# Altium schematic sheet Top.SchDoc
size A; SheetNumber: 1; SheetTotal: 4
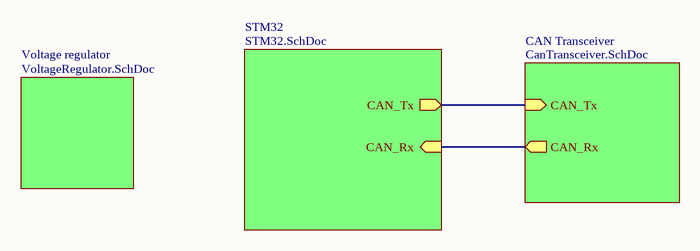
[diagram p0: Top.SchDoc]

## Sub-sheets
CAN Transceiver = CanTransceiver.SchDoc: CAN_Tx (in), CAN_Rx (out)
STM32 = STM32.SchDoc: CAN_Tx (out), CAN_Rx (in)
Voltage regulator = VoltageRegulator.SchDoc: no entries

## Nets
(unnamed): sheet STM32/CAN_Tx, sheet CAN Transceiver/CAN_Tx
(unnamed): sheet STM32/CAN_Rx, sheet CAN Transceiver/CAN_Rx